# Altium schematic sheet Power.SchDoc: =documentname
size 279 x 215 mm; CheckedBy: TBD; Engineer: Yuchen Lin; Organization: UW Robotics; Address1: 200 University Avenue; Address2: Waterloo; Address3: Ontario; Address4: Canada N2L 3G6; DocumentNumber: 1; Revision: 1.0; SheetNumber: 1; SheetTotal: 2; designer: Yuchen Lin; reviewer: TBD; total sheets: 2; version: 1.0
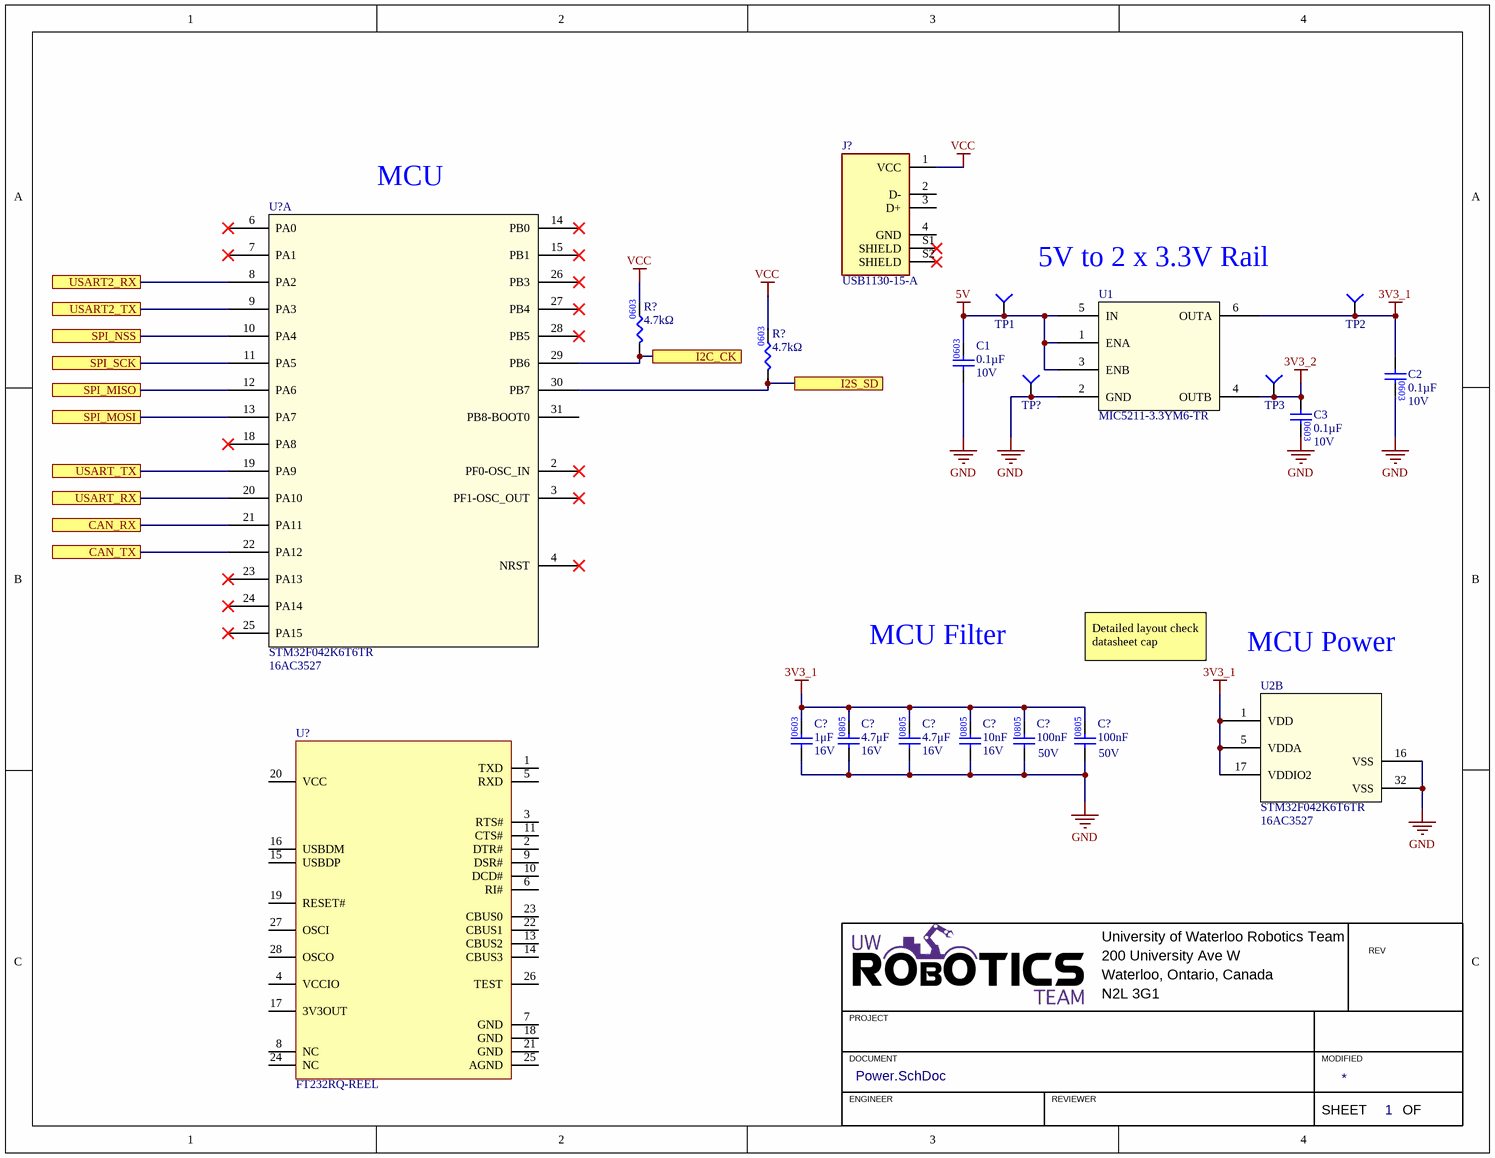
[diagram p0: Power.SchDoc]

## Parts
(Parts that share a designator on the sheet are numbered #1, #2 ... from top to bottom, then left to right.)
C1  value 0.1µF  Voltage Rating: 10V  [CAP0603]  (hidden comment: CAP_0.1uF_10V_0603)
C2  value 0.1µF  Voltage Rating: 10V  [CAP0603]  (hidden comment: CAP_0.1uF_10V_0603)
C3  value 0.1µF  Voltage Rating: 10V  [CAP0603]  (hidden comment: CAP_0.1uF_10V_0603)
C?#1  value 1μF  Voltage Rating: 16V  [CAP0603]  (hidden comment: CAP_1uF_16V_0603)
C?#2  value 4.7μF  Voltage Rating: 16V  [CAP0805]  (hidden comment: CAP_4.7uF_16V_0805)
C?#3  value 4.7μF  Voltage Rating: 16V  [CAP0805]  (hidden comment: CAP_4.7uF_16V_0805)
C?#4  value 10nF  Voltage Rating: 16V  [CAP0805]  (hidden comment: CAP_10nF_16V_0805)
C?#5  value 100nF  Voltage Rating: 50V  [CAP0805]  (hidden comment: CAP_100nF_50V_0805)
C?#6  value 100nF  Voltage Rating: 50V  [CAP0805]  (hidden comment: CAP_100nF_50V_0805)
J?  Manufacturer Part Number 1: USB1130-15-A  [USB-A 2.0 Connector - 3d ver]  (hidden comment: USB-A 2.0 Connector)
R?#1  value 4.7kΩ  [RES0603]  (hidden comment: RES_4.7kΩ_0603_5%)
R?#2  value 4.7kΩ  [RES0603]  (hidden comment: RES_4.7kΩ_0603_5%)
TP1  TESTPOINT_SMD_LOOP  [S1751-46R]  (value not drawn)
TP2  TESTPOINT_SMD_LOOP  [S1751-46R]  (value not drawn)
TP3  TESTPOINT_SMD_LOOP  [S1751-46R]  (value not drawn)
TP?  TESTPOINT_SMD_LOOP  [S1751-46R]  (value not drawn)
U1  MIC5211-3.3YM6-TR  [SOT-23-6_M6_MCH]
U2  STM32F042K6T6TR  Supplier Part Number 1: 16AC3527  [LQFP-32]  (part B of 2)
U?#1  STM32F042K6T6TR  Supplier Part Number 1: 16AC3527  [LQFP-32]  (part A of 2)
U?#2  FT232RQ-REEL  [FT232RQ-REEL_FTD]

## Ports
CAN_RX, CAN_TX, I2C_CK, I2S_SD, SPI_MISO, SPI_MOSI, SPI_NSS, SPI_SCK, USART2_RX, USART2_TX, USART_RX, USART_TX

## Nets
3V3_1: C2.1 C?#1.2 C?#2.2 C?#3.2 C?#4.2 C?#5.2 C?#6.2 TP2.1(=value) U1.6(OUTA) U2.1(VDD) U2.5(VDDA) U2.17(VDDIO2)
3V3_2: C3.1 TP3.1(=value) U1.4(OUTB)
5V: C1.2 TP1.1(=value) U1.1(ENA) U1.3(ENB) U1.5(IN)
GND: C1.1 C2.2 C3.2 C?#1.1 C?#2.1 C?#3.1 C?#4.1 C?#5.1 C?#6.1 TP?.1(=value) U1.2(GND) U2.16(VSS) U2.32(VSS)
VCC: J?.1(VCC) R?#1.2 R?#2.2
CAN_RX: U?#1.21(PA11) ; port CAN_RX
CAN_TX: U?#1.22(PA12) ; port CAN_TX
I2C_CK: R?#1.1 U?#1.29(PB6) ; port I2C_CK
I2S_SD: R?#2.1 U?#1.30(PB7) ; port I2S_SD
SPI_MISO: U?#1.12(PA6) ; port SPI_MISO
SPI_MOSI: U?#1.13(PA7) ; port SPI_MOSI
SPI_NSS: U?#1.10(PA4) ; port SPI_NSS
SPI_SCK: U?#1.11(PA5) ; port SPI_SCK
USART2_RX: U?#1.8(PA2) ; port USART2_RX
USART2_TX: U?#1.9(PA3) ; port USART2_TX
USART_RX: U?#1.20(PA10) ; port USART_RX
USART_TX: U?#1.19(PA9) ; port USART_TX

Not connected (* = marked no-connect by the designer): J? 2(D-) 3(D+) 4(GND) S1(SHIELD)* S2(SHIELD)*; U?#1 2(PF0-OSC_IN)* 3(PF1-OSC_OUT)* 4(NRST)* 6(PA0)* 7(PA1)* 14(PB0)* 15(PB1)* 18(PA8)* 23(PA13)* 24(PA14)* 25(PA15)* 26(PB3)* 27(PB4)* 28(PB5)* 31(PB8-BOOT0); U?#2 1(TXD) 2(DTR#) 3(RTS#) 4(VCCIO) 5(RXD) 6(RI#) 7(GND) 8(NC) 9(DSR#) 10(DCD#) 11(CTS#) 13(CBUS2) 14(CBUS3) 15(USBDP) 16(USBDM) 17(3V3OUT) 18(GND) 19(RESET#) 20(VCC) 21(GND) 22(CBUS1) 23(CBUS0) 24(NC) 25(AGND) 26(TEST) 27(OSCI) 28(OSCO)

## Notes on the sheet
- (near U?#1) MCU
- 5V to 2 x 3.3V Rail
- MCU Filter
- Detailed layout check datasheet cap
- MCU Power
- University of Waterloo Robotics Team
- 200 University Ave W
- REV
- PROJECT
- Waterloo, Ontario, Canada
- N2L 3G1
- DOCUMENT
- ENGINEER
- REVIEWER
- MODIFIED
- SHEET
- OF
- (in symbol CAP_0.1uF_10V_0603) 0603
- (in symbol CAP_10nF_16V_0805) 0805
- (in symbol RES_4.7kΩ_0603_5%) 0603

## Library data of the parts
C1-C3 = CAP_0.1uF_10V_0603: CAP CER 0.1UF 10V X7R 0402; Manufacturer 1: Murata Electronics; Manufacturer Part Number 1: GRM155R71A104KA01D; Package/Footprint: 0402; Supplier 1: Digi-Key; Supplier Part Number 1: 490-6321-1-ND
C?#1 = CAP_1uF_16V_0603: CAP CER 1UF 16V Y5V 0603; Manufacturer 1: Yageo; Manufacturer Part Number 1: CC0603ZRY5V7BB105; Supplier Part Number 1: 311-1372-1-ND; Supplier 1: Digi-Key; Mounting Type: SMD; Package: 0603; Dielectric: Y5V
C?#2 C?#3 = CAP_4.7uF_16V_0805: CAP CER 4.7UF 16V X5R 0805; Manufacturer 1: Samsung Electro-Mechanics; Manufacturer Part Number 1: CL21A475KOFNNNE; Mounting Type: SMD; Supplier 1: Digi-Key; Supplier Part Number 1: 1276-1065-1-ND; Package: 0805; LCSC Part #: C1779; Dielectric: X5R
C?#4 = CAP_10nF_16V_0805: CAP CER 10000PF 16V X7R 0805; Manufacturer 1: Yageo; Manufacturer Part Number 1: AC0805KRX7R7BB103; Supplier 1: Digi-Key; Supplier Part Number 1: 311-3161-1-ND
C?#5 C?#6 = CAP_100nF_50V_0805: CAP CER 0.1UF 50V X7R 0805; Manufacturer 1: Samsung Electro-Mechanics; Manufacturer Part Number 1: CL21B104KBCNNNC; Package/Footprint: 0805; Supplier 1: Digi-Key; Supplier Part Number 1: 1276-1003-1-ND
J? = USB-A 2.0 Connector: USB-A (USB TYPE-A) USB 2.0 Receptacle Connector 4 Position Through Hole, Right Angle; Manufacturer 1: GCT; Supplier 1: Digi-Key; Supplier Part Number 1: 2073-USB1130-15-ACT-ND
R?#1 R?#2 = RES_4.7kΩ_0603_5%: RES 4.7K OHM 5% 1/10W 0603; Manufacturer 1: Yageo; Manufacturer Part Number 1: RC0603JR-074K7L; Supplier Part Number 1: 311-4.7KGRCT-ND; Supplier 1: Digi-Key
TP1-TP3 TP? = TESTPOINT_SMD_LOOP: TESTPOINT SMD LOOP; Manufacturer 1: Harwin; Supplier 1: Digi-Key; Manufacturer Part Number 1: S1751-46R; Mounting Type: SMD; Package/Footprint: SMD; Supplier Part Number 1: 952-1478-1-ND
U1 = MIC5211-3.3YM6-TR: Linear Voltage Regulator IC Positive Fixed 2 Output 80mA, 80mA SOT-23-6; Mfr_Name: Microchip; Voltage - Input (Max): 16; Output Type: 3.3V; Package / Case: SOT-23-6; ComponentLink1Description: digikey; ComponentLink1URL: https://www.digikey.ca/en/products/detail/microchip-technology/MIC5211-3-3YM6-TR/1616942
U2 U?#1 = STM32F042K6T6TR: ARM® Cortex®-M0 STM32F0 Microcontroller IC 32-Bit Single-Core 48MHz 32KB (32K x 8) FLASH 32-LQFP (7x7); Mfr_Name: STMicroelectronics; Voltage - Supply (Vcc/Vdd): 2V ~ 3.6V; Core Processor: ARM® Cortex®-M0; Core Size: 32-Bit Single-Core; Speed: 48MHz; Program Memory Size: 32KB (32K x 8); Operating Temperature: -40°C ~ 85°C (TA); Package / Case: 32-LQFP; ComponentLink1Description: digikey; ComponentLink1URL: https://www.digikey.com/en/products/detail/stmicroelectronics/STM32F042K6T6TR/10414582; Supplier 1: Avnet
U?#2 = FT232RQ-REEL: USB Bridge, USB to UART USB 2.0 UART Interface 32-QFN (5x5); Manufacturer: FTDI; Max Frequency: 48MHz; Package Equivalence Code: LCC32,.2SQ,20; Max Supply Voltage: 5.25V; Min Supply Voltage: 3.3V; Max Supply Current: 100uA; Qualification Status: Not Qualified; Supplier 1: Digi-Key; Supplier Part Number 1: 768-1008-1-ND; RoHS: Yes; Category: Interface ICs; Pricing 1: 1=4.70000, 10=4.25000, 50=4.05000, 100=3.85000, 250=3.45000, 500=3.05000, 1000=2.85002, 2500=2.55001 (USD); Package Code: HVQCCN; Number of Pins: 32; Package Shape: Square; Min Operating Temperature: -40°C; Max Operating Temperature: 85°C; JESD-30 Code: S-XQCC-N32; Moisture Sensitivity Level: 3; Package Style: CHIP CARRIER, HEAT SINK/SLUG, VERY THIN PROFILEMeter; Surface Mount: Yes; Technology: CMOS; Terminal Form: No Lead; Terminal Position: QUAD; Length: 5mm; Width: 5mm; Height - Seated (Max): 1mm; Terminal Pitch: 0.5mm; Temperature Grade: INDUSTRIAL; REACH SVHC: Yes; RoHS Compliant: Yes; ComponentLink1URL: https://datasheet.ciiva.com:443/pdfs/VipMasterIC/IC/FTDI/FTDI-S-A0007980421/FTDI-S-A0007980421-1.pdf?src-supplier=IHS+Markit; ComponentLink1Description: https://datasheet.ciiva.com:443/pdfs/VipMasterIC/IC/FTDI/FTDI-S-A0007980421/FTDI-S-A0007980421-1.pdf?src-supplier=IHS+Markit; ComponentLink2URL: https://datasheet.ciiva.com/1505/1647396-1505445.pdf?src-supplier=Digi-Key; ComponentLink2Description: https://datasheet.ciiva.com/1505/1647396-1505445.pdf?src-supplier=Digi-Key; ComponentLink3URL: https://datasheet.ciiva.com/26841/ft232rq-reel-26841082.pdf?src-supplier=IIIC; ComponentLink3Description: https://datasheet.ciiva.com/26841/ft232rq-reel-26841082.pdf?src-supplier=IIIC; ComponentLink4URL: https://datasheet.ciiva.com/16438/ds-ft232r-16438555.pdf?src-supplier=Future+Electronics; ComponentLink4Description: https://datasheet.ciiva.com/16438/ds-ft232r-16438555.pdf?src-supplier=Future+Electronics; ComponentLink5URL: https://datasheet.ciiva.com/15150/getdatasheetpartid-644721-15150509.pdf?src-supplier=Verical; ComponentLink5Description: https://datasheet.ciiva.com/15150/getdatasheetpartid-644721-15150509.pdf?src-supplier=Verical; ComponentLink6URL: https://datasheet.ciiva.com/4787/ds-ft232r-4787663.pdf?src-supplier=Mouser; ComponentLink6Description: https://datasheet.ciiva.com/4787/ds-ft232r-4787663.pdf?src-supplier=Mouser; ComponentLink7URL: https://datasheet.ciiva.com/1787/ds-ft232r-1787041.pdf?src-supplier=Digi-Key; ComponentLink7Description: https://datasheet.ciiva.com/1787/ds-ft232r-1787041.pdf?src-supplier=Digi-Key; ComponentLink8URL: https://datasheet.ciiva.com/1787/ds-ft232r-1787042.pdf?src-supplier=Digi-Key; ComponentLink8Description: https://datasheet.ciiva.com/1787/ds-ft232r-1787042.pdf?src-supplier=Digi-Key; Manufacturer Part Number: FT232RQ-REEL